# EAGLE design untitled (EAGLE 7.3.0)
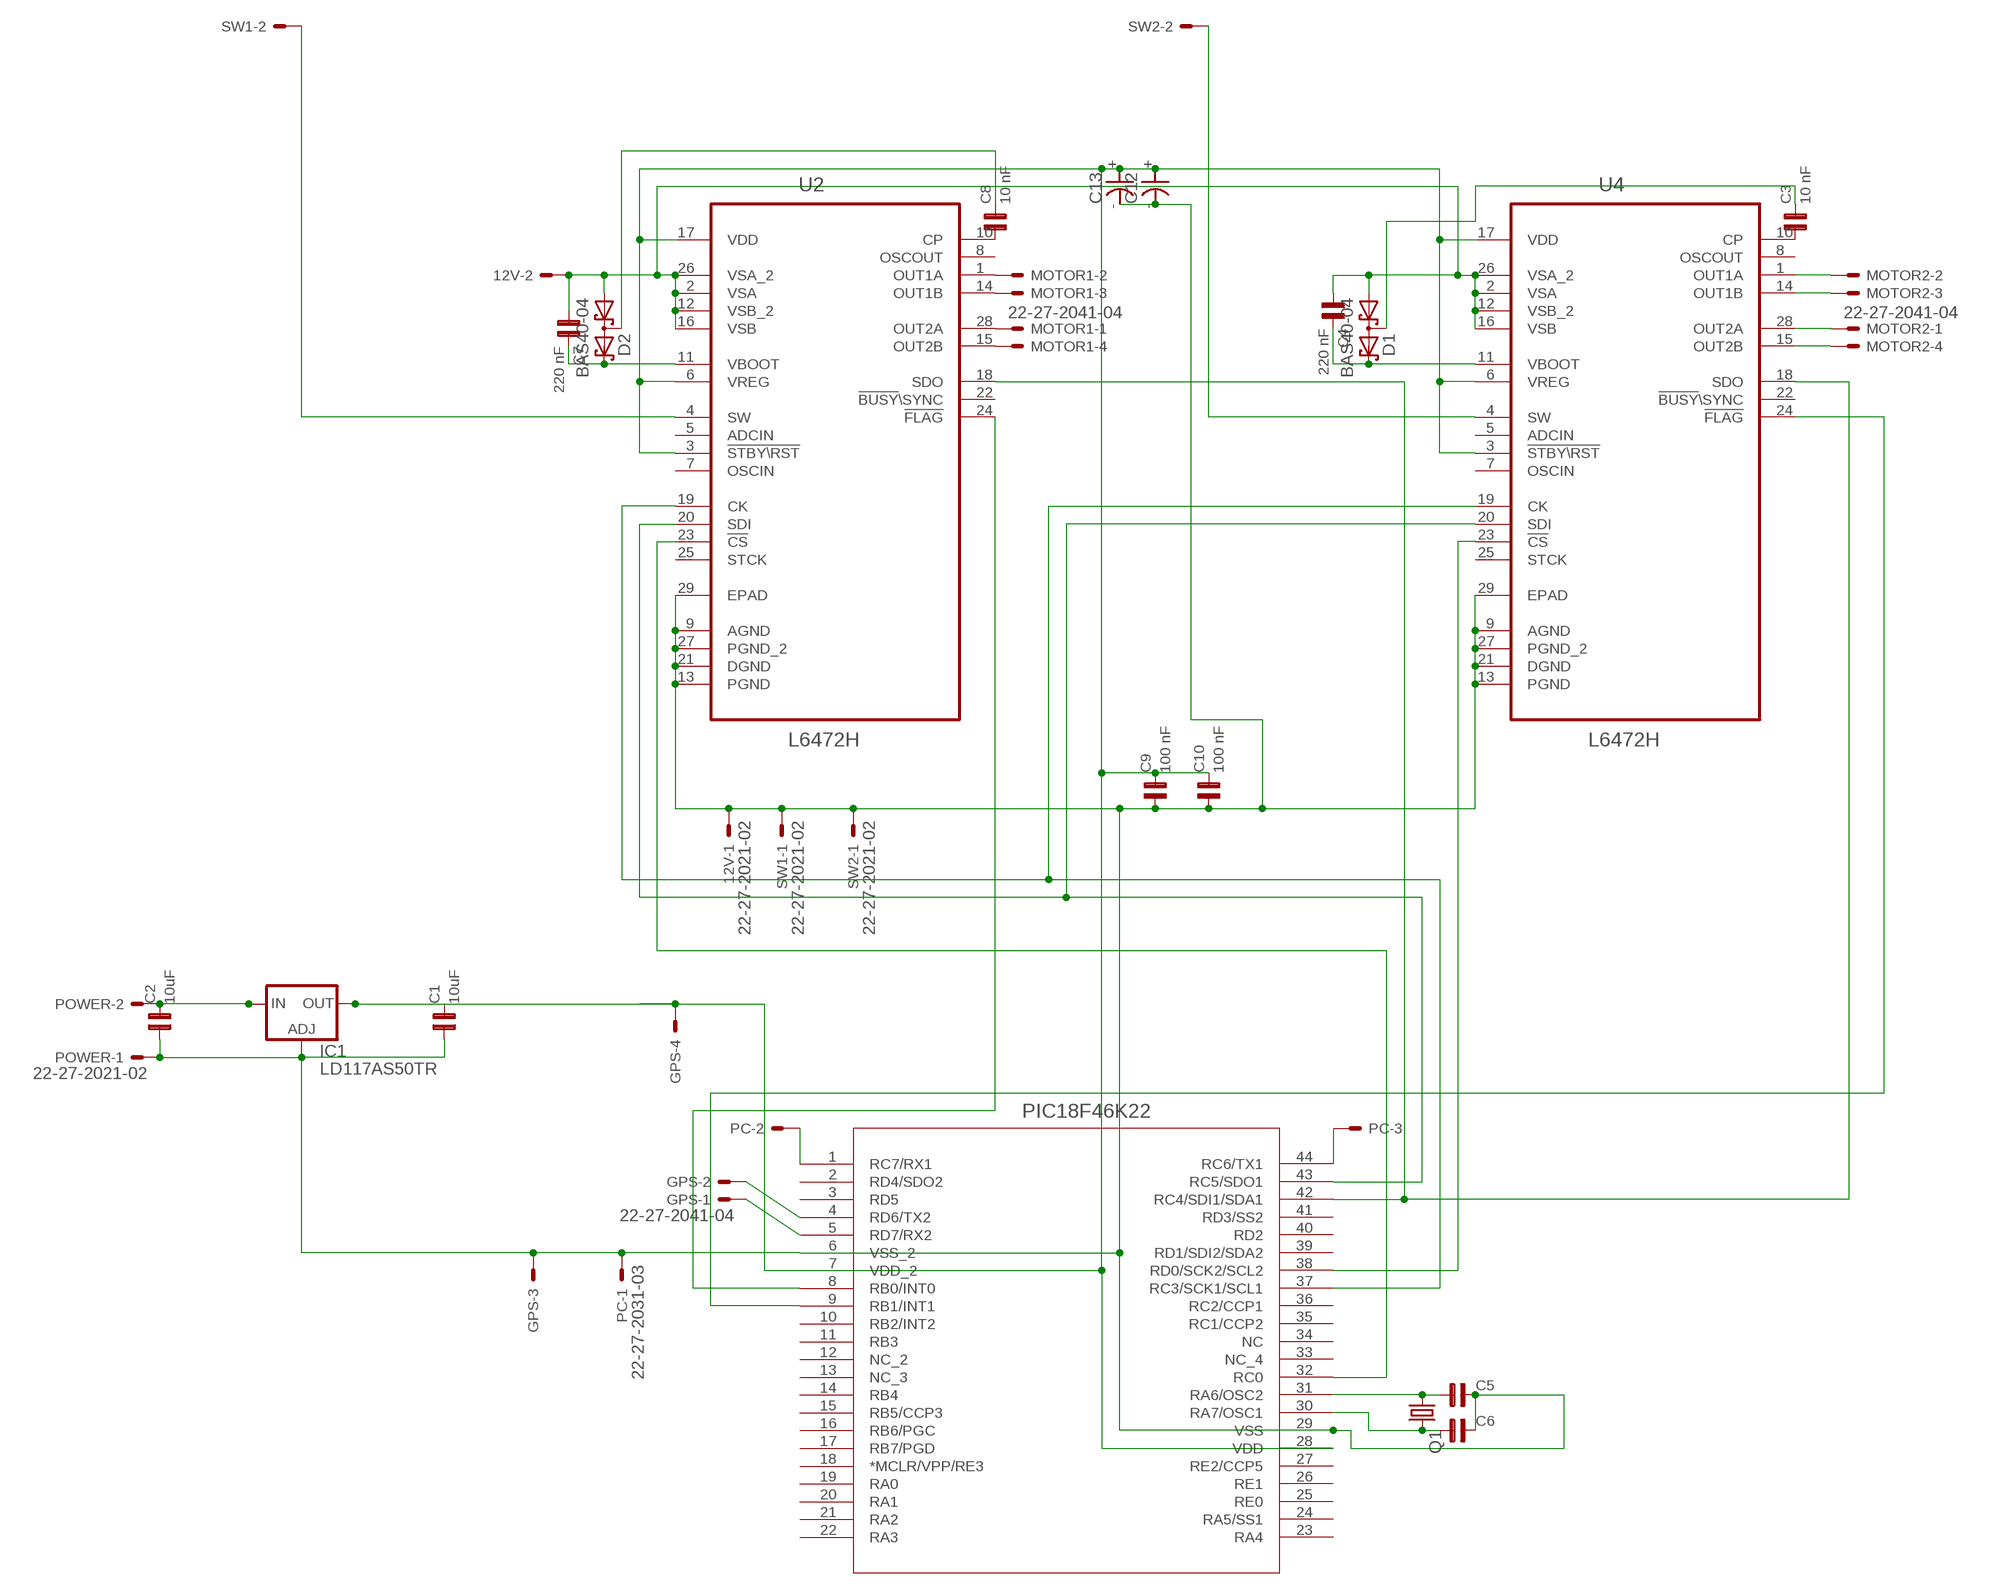
[diagram p0: schematic, sheet 1]

## Parts
12V  22-27-2021-02  [6410-02]
C1  10uF  C0603  [0603]
C2  10uF  C0603  [0603]
C3  10 nF  C0603  [0603]
C4  220 nF  C0603  [0603]
C5  C0603  [0603]
C6  C0603  [0603]
C7  220 nF  C0603  [0603]
C8  10 nF  C0603  [0603]
C9  100 nF  C0603  [0603]
C10  100 nF  C0603  [0603]
C12  C7243  [7243]
C13  C7243  [7243]
D1  BAS40-04  [SOT23]
D2  BAS40-04  [SOT23]
GPS  22-27-2041-04  [6410-04]
IC1  LD117AS50TR  [SOT223]
MOTOR1  22-27-2041-04  [6410-04]
MOTOR2  22-27-2041-04  [6410-04]
PC  22-27-2031-03  [6410-03]
POWER  22-27-2021-02  [6410-02]
Q1  CRYSTALHC49S  [HC49/S]
SW1  22-27-2021-02  [6410-02]
SW2  22-27-2021-02  [6410-02]
U1  PIC18F46K22-X_PT  [TQFP44_10X10MC]
U2  L6472H  [SOP65P640X120-29N]
U4  L6472H  [SOP65P640X120-29N]

## Nets
3.3V: C1.2 C9.2 C10.2 C12.+ C13.+ GPS.4 IC1.4(OUT) U1.7(VDD_2) U1.28(VDD) U2.3(!STBY\RST) U2.6(VREG) U2.17(VDD) U4.3(!STBY\RST) U4.6(VREG) U4.17(VDD)
12V: 12V.2 C4.1 C7.1 D1.1(A1) D2.1(A1) U2.2(VSA) U2.12(VSB_2) U2.16(VSB) U2.26(VSA_2) U4.2(VSA) U4.12(VSB_2) U4.16(VSB) U4.26(VSA_2)
CS1: U1.32(RC0) U2.23(!CS)
CS2: U1.38(RD0/SCK2/SCL2) U4.23(!CS)
FLAG1: U1.8(RB0/INT0) U2.24(!FLAG)
FLAG2: U1.9(RB1/INT1) U4.24(!FLAG)
GND: 12V.1 C1.1 C2.1 C5.2 C6.2 C9.1 C10.1 C12.- C13.- GPS.3 IC1.1(ADJ) PC.1 POWER.1 SW1.1 SW2.1 U1.6(VSS_2) U1.29(VSS) U2.9(AGND) U2.13(PGND) U2.21(DGND) U2.27(PGND_2) U2.29(EPAD) U4.9(AGND) U4.13(PGND) U4.21(DGND) U4.27(PGND_2) U4.29(EPAD)
N$1: C5.1 Q1.1 U1.31(RA6/OSC2)
N$2: C6.1 Q1.2 U1.30(RA7/OSC1)
N$7: C2.2 IC1.3(IN) POWER.2
N$8: MOTOR1.1 U2.28(OUT2A)
N$9: MOTOR1.2 U2.1(OUT1A)
N$10: MOTOR1.3 U2.14(OUT1B)
N$11: MOTOR1.4 U2.15(OUT2B)
N$12: MOTOR2.1 U4.28(OUT2A)
N$13: MOTOR2.2 U4.1(OUT1A)
N$14: MOTOR2.3 U4.14(OUT1B)
N$15: MOTOR2.4 U4.15(OUT2B)
N$16: C4.2 D1.2(C2) U4.11(VBOOT)
N$17: C3.1 U4.10(CP)
N$19: C3.2 D1.3(C1A2)
N$22: SW1.2 U2.4(SW)
N$25: C8.1 U2.10(CP)
N$26: C8.2 D2.3(C1A2)
N$27: C7.2 D2.2(C2) U2.11(VBOOT)
RX1: PC.2 U1.1(RC7/RX1)
RX2: GPS.1 U1.5(RD7/RX2)
SCK: U1.37(RC3/SCK1/SCL1) U2.19(CK) U4.19(CK)
SDI: U1.42(RC4/SDI1/SDA1) U2.18(SDO) U4.18(SDO)
SDO: U1.43(RC5/SDO1) U2.20(SDI) U4.20(SDI)
SW2: SW2.2 U4.4(SW)
TX1: PC.3 U1.44(RC6/TX1)
TX2: GPS.2 U1.4(RD6/TX2)
Unconnected: U1.2(RD4/SDO2) U1.3(RD5) U1.10(RB2/INT2) U1.11(RB3) U1.12(NC_2) U1.13(NC_3) U1.14(RB4) U1.15(RB5/CCP3) U1.16(RB6/PGC) U1.17(RB7/PGD) U1.18(*MCLR/VPP/RE3) U1.19(RA0) U1.20(RA1) U1.21(RA2) U1.22(RA3) U1.23(RA4) U1.24(RA5/SS1) U1.25(RE0) U1.26(RE1) U1.27(RE2/CCP5) U1.33(NC_4) U1.34(NC) U1.35(RC1/CCP2) U1.36(RC2/CCP1) U1.39(RD1/SDI2/SDA2) U1.40(RD2) U1.41(RD3/SS2) U2.5(ADCIN) U2.7(OSCIN) U2.8(OSCOUT) U2.22(!BUSY!\SYNC) U2.25(STCK) U4.5(ADCIN) U4.7(OSCIN) U4.8(OSCOUT) U4.22(!BUSY!\SYNC) U4.25(STCK)

## Library data of the parts
12V POWER SW1 SW2 = con-molex:22-?-02: CONNECTOR wire to board 2.54 mm (.1 inch) pitch header; OC_FARNELL: unknown; OC_NEWARK: unknown
C1-C10 = capsmd:C0603
C12 C13 = capsmd:C7243
D1 D2 = diode:BAS40-04: Silicon Schottky Diodes General-purpose diode for high-speed switching
GPS MOTOR1 MOTOR2 = con-molex:22-?-04: CONNECTOR wire to board 2.54 mm (.1 inch) pitch header; OC_FARNELL: unknown; OC_NEWARK: unknown
IC1 = v-reg:LD117A?*: Low drop fixed and adjustable positive voltage regulators 1 A Source: http://www.st.com/stonline/products/literature/ds/7194/ld1117axx.pdf
PC = con-molex:22-?-03: CONNECTOR wire to board 2.54 mm (.1 inch) pitch header; OC_FARNELL: unknown; OC_NEWARK: unknown
Q1 = crystal:CRYSTAL: CRYSTAL; OC_FARNELL: 1667008; OC_NEWARK: unknown
U1 = Microchip2:PIC18F46K22-X_PT
U2 U4 = st-microelectronics:L6472H: dSPIN fully integrated microstepping motor driver,28HTSSOP; MPN: L6472H; OC_FARNELL: 2309413; OC_NEWARK: 69W9794; PACKAGE: HTSSOP-28; SUPPLIER: STMICROELECTRONICS

## Board
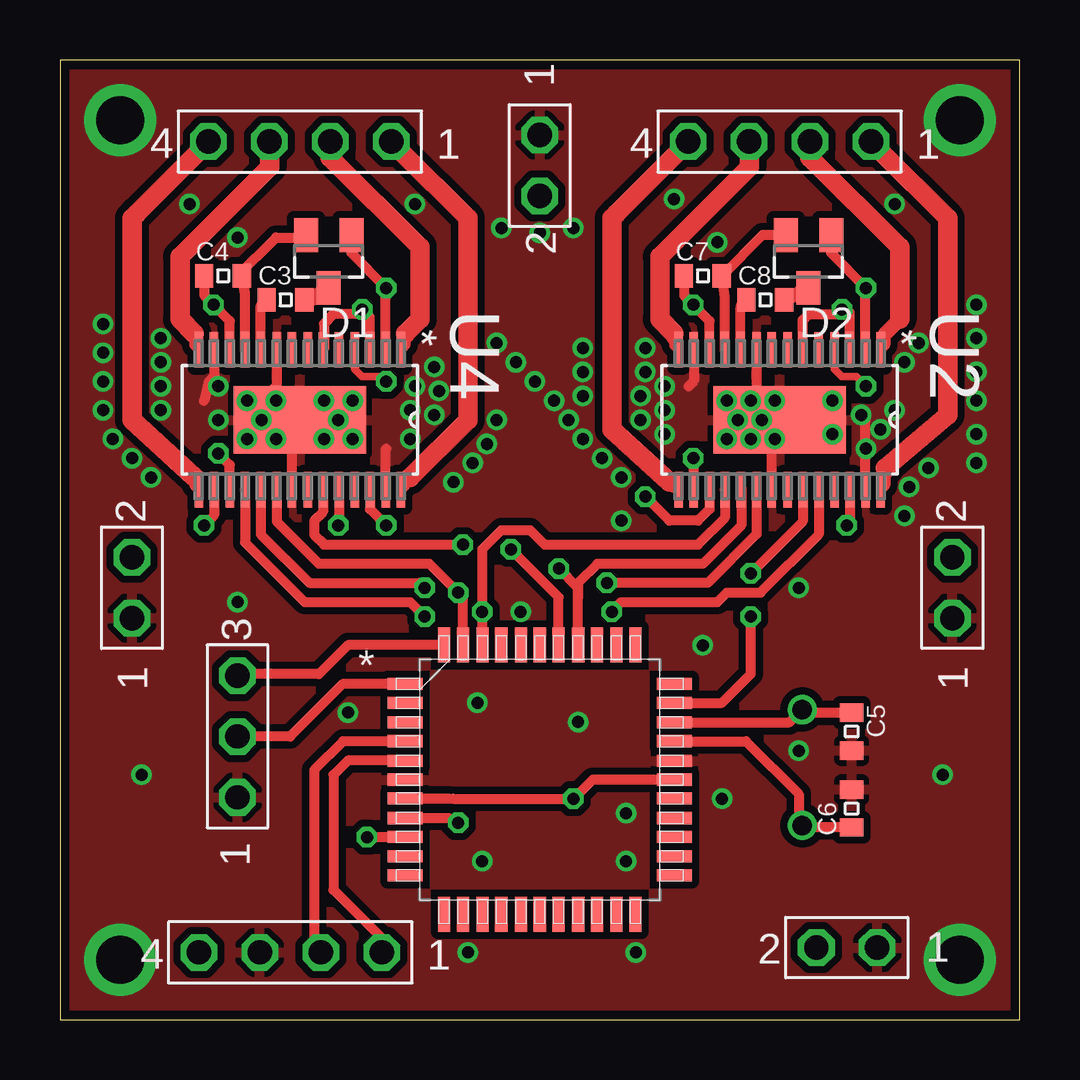
[diagram p1: board, top side]
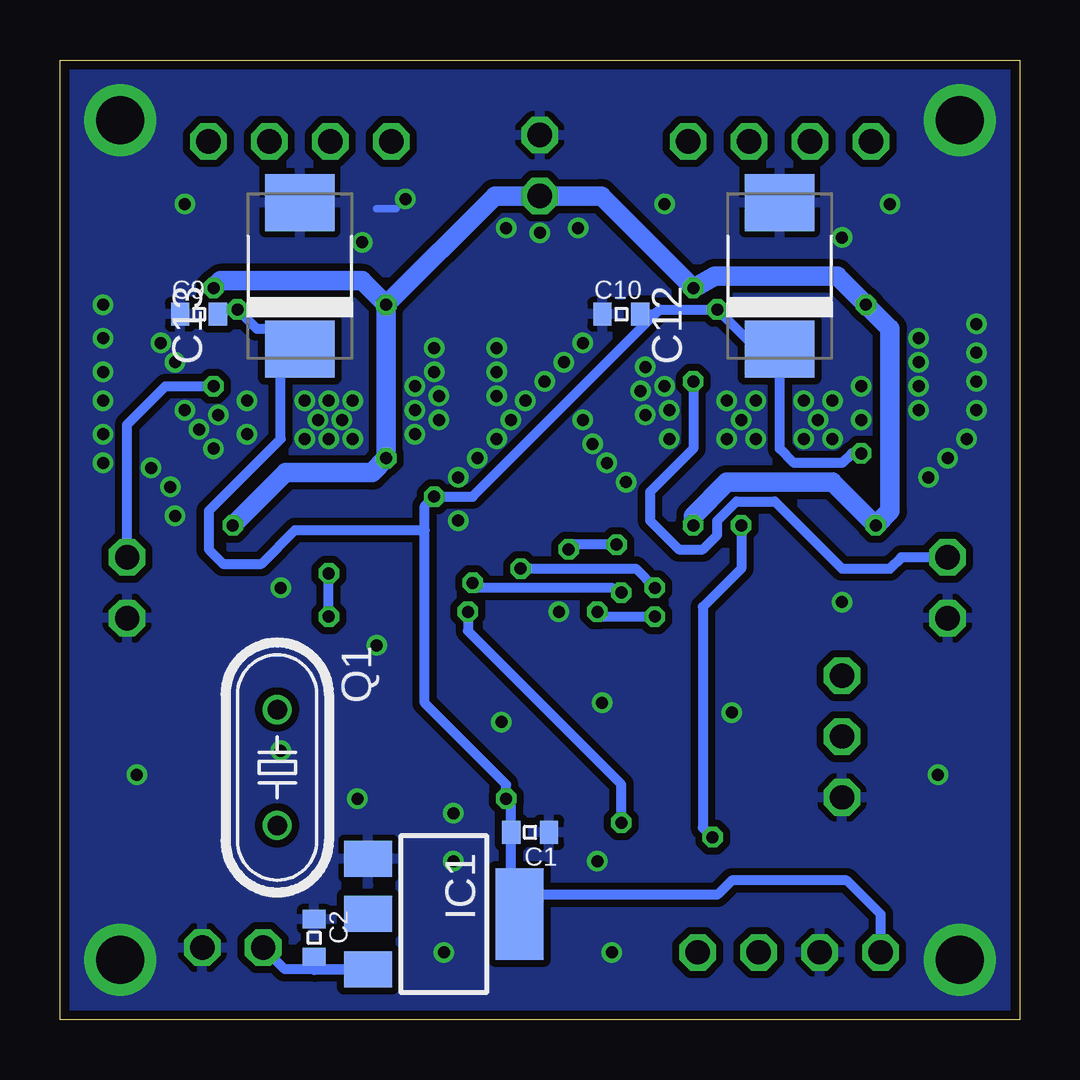
[diagram p2: board, bottom side, seen from below]

Size 40 x 40 mm. Coordinates in mm from the lower left corner, seen from the top.
Outline: 0,0 40,0 40,40 0,40 0,0
Copper layers (1+16): Top 0.0356mm / dielectric 1.5011mm / Bottom 0.0356mm
Design rules "LaenPCBOrder *": minimum track width 6mil, minimum drill 13mil, track to track 6mil, track to pad 6mil, pad to pad 6mil, via to via 6mil, smd to smd 6mil, copper to edge 15mil, drill to drill 6mil, minimum pad ring 7mil, minimum via ring 7mil, stop-mask expansion 4mil, vias tented up to drill 24mil, thermal gap 10mil

### Footprints (pad centres in the part's own frame; a part is rotated, then mirrored left to right if it is on the bottom)
6410-02 = drill 1.016 octagon: 1 1.27,0; 2 -1.27,0
0603 = smd 0.762 x 0.965: 1 -0.787,0; 2 0.787,0
7243 = smd 2.388 x 2.896: + -3.048,0; - 3.048,0
SOT23 = smd 1 x 1.4: 1 -0.95,-1.1; 2 0.95,-1.1; 3 0,1.1
6410-04 = drill 1.016 octagon: 1 3.81,0; 2 1.27,0; 3 -1.27,0; 4 -3.81,0
SOT223 = smd 1.5 x 2: 1 -2.3,-3.15; 2 0,-3.15; 3 2.3,-3.15 | smd 3.8 x 2: 4 0,3.15
6410-03 = drill 1.016 octagon: 1 2.54,0; 2 0,0; 3 -2.54,0
HC49/S = drill 0.813: 1 -2.413,0; 2 2.413,0
TQFP44_10X10MC = smd 1.473 x 0.508: 1 -5.613,3.988; 2 -5.613,3.2; 3 -5.613,2.388; 4 -5.613,1.6; 5 -5.613,0.787; 6 -5.613,0; 7 -5.613,-0.787; 8 -5.613,-1.6; 9 -5.613,-2.388; 10 -5.613,-3.2; 11 -5.613,-3.988; 23 5.613,-3.988; 24 5.613,-3.2; 25 5.613,-2.388; 26 5.613,-1.6; 27 5.613,-0.787; 28 5.613,0; 29 5.613,0.787; 30 5.613,1.6; 31 5.613,2.388; 32 5.613,3.2; 33 5.613,3.988 | smd 0.508 x 1.473: 12 -3.988,-5.613; 13 -3.2,-5.613; 14 -2.388,-5.613; 15 -1.6,-5.613; 16 -0.787,-5.613; 17 0,-5.613; 18 0.787,-5.613; 19 1.6,-5.613; 20 2.388,-5.613; 21 3.2,-5.613; 22 3.988,-5.613; 34 3.988,5.613; 35 3.2,5.613; 36 2.388,5.613; 37 1.6,5.613; 38 0.787,5.613; 39 0,5.613; 40 -0.787,5.613; 41 -1.6,5.613; 42 -2.388,5.613; 43 -3.2,5.613; 44 -3.988,5.613
SOP65P640X120-29N = smd 1.473 x 0.356: 1 -2.921,4.216; 2 -2.921,3.581; 3 -2.921,2.921; 4 -2.921,2.286; 5 -2.921,1.626; 6 -2.921,0.965; 7 -2.921,0.33; 8 -2.921,-0.33; 9 -2.921,-0.965; 10 -2.921,-1.626; 11 -2.921,-2.286; 12 -2.921,-2.921; 13 -2.921,-3.581; 14 -2.921,-4.216; 15 2.921,-4.216; 16 2.921,-3.581; 17 2.921,-2.921; 18 2.921,-2.286; 19 2.921,-1.626; 20 2.921,-0.965; 21 2.921,-0.33; 22 2.921,0.33; 23 2.921,0.965; 24 2.921,1.626; 25 2.921,2.286; 26 2.921,2.921; 27 2.921,3.581; 28 2.921,4.216 | smd 2.794 x 5.512: 29 0,0

### Placement (x,y rotation side)
12V  20,35.6 90 top
C1  20.4,7.8 180 bottom
C2  29.4,3.4 270 bottom
C3  9.4,30 0 top
C4  6.8,31 0 top
C5  33,12 270 top
C6  33,8.8 90 top
C7  26.8,31 0 top
C8  29.4,30 0 top
C9  34.2,29.4 0 bottom
C10  16.6,29.4 0 bottom
C12  10,31 90 bottom
C13  30,31 90 bottom
D1  11.2,31.6 180 top
D2  31.2,31.6 180 top
GPS  9.6,2.8 0 top
IC1  24,4.4 270 bottom
MOTOR1  30,36.6 0 top
MOTOR2  10,36.6 0 top
PC  7.4,11.8 270 top
POWER  32.8,3 0 top
Q1  30.94,10.51 270 bottom
SW1  37.2,18 270 top
SW2  3,18 270 top
U1  20,10 0 top
U2  30,25 270 top
U4  10,25 270 top

### Tracks (layer width: path | path; a pad name or v marks a point on that pad's centre or on a via)
3.3V  (via drill 0.5)
  Top 0.406: U1.7 16.21,9.21 16.4,9.2 v21.4,9.2 22.2,10 U1.28 | U2.3 32.92,29.48 v32.6,29.6 32.4,29.4 31.2,29.4 30.96,29.16 U2.6 | U2.17 27.08,21.28 26.6,20.8 25.4,20.8 v24.4,21.8 | U4.3 12.92,29.28 12.8,29.4 12.6,29.4 | U4.6 11,27.96 11,29 11.4,29.4 12.6,29.4 | v12.6,29.6 12.6,29.4 | U1.28 25.8,10 | U1.28 | U4.17 7.08,23.12 v6.6,23.6
  Bottom 0.406: 15.2,29.4 22.8,21.8 v24.4,21.8 24.8,21.4 24.8,20.4 | 24.8,20.4 24.8,13.2 21.4,9.8 v21.4,9.2 21.2,9 C1.2 | 24.8,20.4 30.2,20.4 31.6,19 33.2,19 33.8,19.6 33.8,21.2 30.8,24.2 30.8,27.35 C13.+ 30.45,28.8 31.8,28.8 v32.6,29.6 33,29.6 C9.2 | v6.6,23.6 7,23.6 7.4,23.2 9.4,23.2 10,23.8 10,27 10.5,27.5 v12.6,29.6 15,29.6 15.2,29.4 | C1.2 21.2,6.2 20.85,5.85 IC1.4 20.05,5.2 12.6,5.2 12,5.8 7.2,5.8 5.79,4.39 GPS.4 | C1.2 | C10.2 15.2,29.4
  Bottom 0.61: C12.+ 10.05,27.95 10.5,27.5
12V  (via drill 0.5)
  Top 0.406: 12.15,33.05 D1.1 12.15,31.95 v13.6,30.5 13.58,30.48 U4.2 | U4.26 12.92,21.28 v13.6,20.6 | U4.16 6.42,21.02 v6,20.6 | U2.26 32.92,20.72 v32.8,20.6 | U2.16 26.42,23.38 v26.4,23.4 | U2.2 33.58,30.48 v33.6,30.5 32.15,31.95 D2.1 | U2.12 27.08,29.12 v26.4,29.8 26.01,30.19 C7.1 | U4.12 7.08,29.12 v6.4,29.8 6.01,30.19 C4.1
  Bottom 0.813: v26.4,29.8 v26.4,23.4 27,22.8 30.6,22.8 v32.8,20.6 | v13.6,20.6 13.6,21 12.2,22.4 7.8,22.4 v6,20.6 5.4,21.2 5.4,28.8 v6.4,29.8 7.6,31 12.7,31 v13.6,30.5 17.43,34.33 12V.2 21.87,34.33 v26.4,29.8 | v26.4,29.8 27.4,30.8 33.3,30.8 v33.6,30.5
CS1  (via drill 0.5)
  Top 0.406: U2.23 30.96,20.77 v28.8,18.6 | U1.32 27.6,13.2 28.8,14.4 v28.8,16.8
  Bottom 0.406: v28.8,16.8 v28.8,18.6
CS2  (via drill 0.5)
  Top 0.406: U1.38 20.79,17.61 v18.8,19.6 | U4.23 10.96,21.16 10.6,20.8 10.6,20.2 11,19.8 v16.8,19.8
  Bottom 0.406: v16.8,19.8 18.6,19.8 v18.8,19.6
FLAG1  (via drill 0.5)
  Top 0.406: U1.8 16.2,8.4 v16.6,8.2 | v23,17 23.4,17.4 27.4,17.4 27.8,17.8 29.2,17.8 31.63,20.23 U2.24
  Bottom 0.406: v16.6,8.2 16.6,9.8 23,16.2 v23,17
FLAG2  (via drill 0.5)
  Top 0.406: U1.9 13.97,7.6 v12.8,7.6 | U4.24 11.63,20.77 v11.6,20.6
  Bottom 0.406: v11.6,20.6 11.6,18.8 13.2,17.2 13.2,8 v12.8,7.6
GND  (via drill 0.5, 2)
  Top 0.406: U2.21 29.67,25.07 U2.29 29.04,26.36 U2.9 | U2.13 26.42,26.62 26.2,26.4 | U2.27 33.58,24.98 33.4,25 | U4.21 9.67,24.47 U4.29 9,26 8.6,26 | U4.13 6.42,26.82 6.2,26.6 6,25.8 | U4.27 13.58,23.78 13.6,23.8 | U4.9 9.04,26.43 8.6,26 | 8.6,26 8,26 v7.8,25.8
  Bottom 0.305: 26,33.8 26.8,33.8
  other vias: 4.2,26.4 25.2,26.4 15.8,26.2 33.4,25.2 26.8,15.6 21.6,12.4 23.6,8.6 7.4,17.4 18.2,25 19.8,26.6 32.2,24.4 7.8,24.2 12.2,25.8 12.2,24.2 27.8,25.8 27.8,24.2 32.2,25.8 17.6,6.6 27.6,9.2 37.5,37.5 2.5,37.5 37.5,2.5 2.5,2.5 19.2,17 28.8,25.8 29.8,25.8 28.8,24.2 29.8,24.2 35.8,28.2 33.6,23.8 25.2,25.4 25.2,24.4 34.8,25.4 34.2,24.6 9,25.8 9,24.2 8.4,25 11,25.8 11,24.2 11.6,25 14.6,24.2 14.6,25.4 6.6,26.4 6.6,25 4.2,25.4 4.2,27.4 4.2,28.4 21.2,25 14.8,26.4 24.4,27 24.4,28 17.4,13.2 16.4,22.4 17.2,23.2 17.8,24 18.2,28.2 20.6,25.8 19,27.4 1.8,29 1.8,27.8 1.8,26.6 1.8,25.4 2.2,24.2 3,23.4 3.8,22.6 21.8,24.2 21.8,26 21.8,27 21.8,28 36.2,23 35.4,22.2 35.2,21 38.2,28.4 38.2,27 38.2,24.4 38.2,23.2 35.2,27.4 28.25,25 29.25,25 15.6,25.2 15.6,27.2 22.6,23.4 23.4,22.6 24.2,26 24.2,25 38.2,29.8 38.2,25.8 3.4,10.2 12,12.8 36.8,10.2 34.8,34 25.6,34.2 14.8,34 5.4,34 23.4,20.8 17,2.8 24,2.8 23.6,6.6 30.8,11.2 30.8,18 27.4,32.4 18.4,33 7.4,32.6 21.4,33 20,32.8
  pour Top (isolate 0.305): 0.47,39.87 39.92,39.87 39.72,0.27 0.27,0.27
  pour Bottom (isolate 0.305): 0.4,40 39.8,39.8 39.6,0.4 0.2,0.2
N$1
  Top 0.406: U1.31 30.41,12.39 Q1.1 30.88,12.79 C5.1
N$2
  Top 0.406: U1.30 28.6,11.6 30.8,9.4 30.8,8.15 Q1.2 30.82,8.01 C6.1
N$7
  Bottom 0.406: POWER.2 30.63,2.1 IC1.3 29.39,2.06 C2.2
N$8
  Top 0.406: 34.4,22.8 34.4,22.26 U2.28
  Top 0.61: 34.4,23 34.6,23 34.4,22.8
  Top 0.813: 34.4,23 37,25.2 37,33.4 34.2,36.2 MOTOR1.1
N$9
  Top 0.406: 34.4,28.6 34.4,28.11 U2.1
  Top 0.61: 35,29.2 34.4,28.6
  Top 0.813: 35,29.2 35,32.2 31.27,35.93 MOTOR1.2
N$10
  Top 0.406: 25.6,28.4 25.6,28.11 U2.14
  Top 0.61: 25.6,28.6 25.6,28.4
  Top 0.813: 25.6,28.6 25,29.2 25,31.8 28.73,35.53 MOTOR1.3
N$11
  Top 0.406: 25.4,22.4 25.46,22.2 U2.15
  Top 0.813: 26,36.4 MOTOR1.4 23.19,33.6 23,33.4 23,24.6 25.4,22.4
N$12
  Top 0.406: 14.6,22.6 14.6,22.46 U4.28
  Top 0.813: 14.6,22.6 17,25 17,33.4 14.2,36.2 MOTOR2.1
N$13
  Top 0.406: 14.4,28.6 14.4,28.11 U4.1
  Top 0.813: 14.4,28.6 15,29.2 15,32.2 11.27,35.93 MOTOR2.2
N$14
  Top 0.406: 5.6,28.6 5.6,28.11 U4.14
  Top 0.813: 5.6,28.6 5,29.2 5,31.8 8.73,35.53 MOTOR2.3
N$15
  Top 0.406: 5.58,22.62 5.6,22.62 5.6,22.26 U4.15
  Top 0.813: 5.58,22.62 3,25 3,33.4 3.19,33.6 MOTOR2.4 6,36.4
N$16
  Top 0.406: D1.2 10.15,32.6 9,32.6 7.39,30.99 C4.2 7.71,30.27 U4.11
N$17
  Top 0.406: U4.10 8.37,29.76 C3.1
N$19
  Top 0.406: 10.29,29.9 C3.2
  Top 0.61: D1.3 10.29,29.9
N$22  (via drill 0.5)
  Top 0.305: U2.4 32.29,27.11 32.6,26.8 33.2,26.8 v33.6,26.4
  Bottom 0.406: SW1.2 37.2,24.8 35.6,26.4 v33.6,26.4
N$25
  Top 0.406: U2.10 28.37,29.57 28.4,29.8 28.6,30.19 C8.1
N$26
  Top 0.406: 30.89,30.5 30.29,29.9 | D2.3 30.29,29.9 | 30.29,29.9 C8.2
N$27
  Top 0.406: U2.11 27.71,30.13 C7.2 29.29,32.7 D2.2
RX1
  Top 0.406: U1.1 11.79,13.99 9.6,11.8 PC.2
RX2
  Top 0.406: U1.5 14.37,10.8 12,10.8 11.4,10.2 11.4,5.4 13.4,3.4 GPS.1
SCK  (via drill 0.5)
  Top 0.406: U2.19 28.37,22.23 28.4,22.2 28.4,20.6 26.8,19 22.4,19 21.6,18.2 21.6,17.8 21.6,17.6 | v15.2,18 15,18.2 10.4,18.2 8.37,20.23 U4.19 | U1.37 21.6,17.6 | 21.6,17.6 21.6,18 v20.8,18.8
  Bottom 0.406: v20.8,18.8 16,18.8 v15.2,18
SDI  (via drill 0.5)
  Top 0.406: U2.18 27.71,20.91 26.6,19.8 20.2,19.8 19.6,20.4 18.4,20.4 17.6,19.6 v17.6,17 17.6,15.63 U1.42 | U4.18 7.71,19.89 10.2,17.4 14.6,17.4 v15.2,16.8
  Bottom 0.406: v17.6,17 17.4,16.8 v15.2,16.8
SDO  (via drill 0.5)
  Top 0.406: U2.20 29.04,20.23 27,18.2 v22.8,18.2 | U4.20 9.04,20.77 10.8,19 15.4,19 v16.6,17.8 16.8,17.6 U1.43
  Bottom 0.406: v16.6,17.8 | v16.6,17.8 17,18 22.6,18 v22.8,18.2
SW2  (via drill 0.5)
  Top 0.305: U4.4 12.29,27.11 12.6,26.8 13.4,26.8 v13.6,26.6
  Bottom 0.406: v13.6,26.6 13.6,23.8 15.4,22 15.4,20.8 14.2,19.6 13.2,19.6 12.6,20.2 12.6,20.8 11.8,21.6 10.2,21.6 7.4,18.8 5.4,18.8 4.93,19.27 SW2.2
TX1
  Top 0.406: U1.44 12.01,15.61 10.8,14.4 7.46,14.4 PC.3
TX2
  Top 0.406: U1.4 11.8,11.6 10.6,10.4 10.6,3.07 GPS.2